# EAGLE design light_switch_smd (EAGLE 7.5.0)
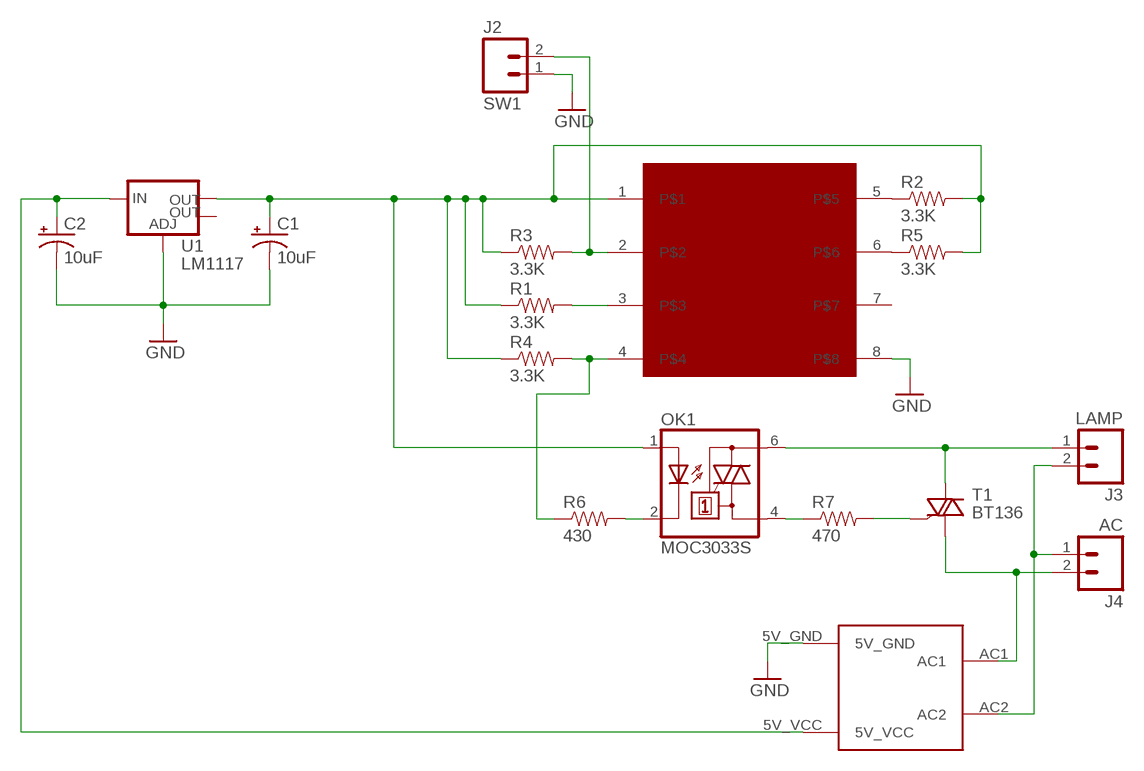
[diagram p0: schematic, sheet 1]

## Parts
C1  10uF  10UF-16V-10%(TANT)  [EIA3216]
C2  10uF  10UF-16V-10%(TANT)  [EIA3216]
J2  SW1  M02PTH3  [1X02_LONGPADS]
J3  LAMP  M02JST-PTH-VERT  [JST-2-PTH-VERT]
J4  AC  M02JST-PTH-VERT  [JST-2-PTH-VERT]
OK1  MOC3033S  [DIL6-SMD]
R1  3.3K  RESISTOR1206  [1206]
R2  3.3K  RESISTOR1206  [1206]
R3  3.3K  RESISTOR1206  [1206]
R4  3.3K  RESISTOR1206  [1206]
R5  3.3K  RESISTOR1206  [1206]
R6  430  RESISTOR1206  [1206]
R7  470  RESISTOR1206  [1206]
T1  BT136  [TO220AB]
U1  LM1117  V_REG_LM1117SOT223  [SOT223]
U$1  HI-LINK5V-ACDC  [AC5V]
U$2  ESP8266-01  [ESP8266-01]

## Nets
GND: C1.C(-) C2.C(-) J2.1 U1.1(ADJ) U$1.5V_GND U$2.8
N$1: J2.2 R3.2 U$2.2
N$2: R2.1 U$2.5
N$3: C1.A(+) OK1.1(A) R1.1 R2.2 R3.1 R4.1 R5.2 U1.2(OUT) U$2.1
N$4: R1.2 U$2.3
N$5: OK1.2(C) R6.2
N$6: R7.2 T1.3(G)
N$7: OK1.4(A1) R7.1
N$8: J3.1 OK1.6(A2) T1.2(A2)
N$9: R4.2 R6.1 U$2.4
N$11: J3.2 J4.1 U$1.AC2
N$12: J4.2 T1.1(A1) U$1.AC1
N$13: C2.A(+) U1.3(IN) U$1.5V_VCC
N$14: R5.1 U$2.6
Unconnected: U1.4(OUT) U$2.7

## Library data of the parts
C1 C2 = SparkFun-Capacitors:10UF-16V-10%(TANT): CAP-00811 1206/EIA-3216 Tantalum capacitor; PROD_ID: CAP-00811
J2-J4 = SparkFun-Connectors:M02: Standard 2-pin 0.1" header. Use with - straight break away headers ( PRT-00116) - right angle break away headers (PRT-00553) - swiss pins (PRT-00743) - machine pins (PRT-00117) - female headers (PRT-00115) Molex polarized connector foot print use with: PRT-08233 with associated crimp pins and housings. 2.54_SCREWTERM for use with PRT-10571. 3.5mm Screw Terminal footprints for PRT-08084 5mm Screw Terminal footprints for use with PRT-08432
OK1 = optocoupler:MOC30*: 6-Pin DIP Zero-Cross Optoisolators Triac Driver Output (250/400 Volt Peak) Source: Data sheet <http://www.fairchildsemi.com/ds/MO/MOC3031M.pdf> The old path of data sheet not more available 2013-05-06.; MF: FAIRCHILD SEMICONDUCTOR; MPN: MOC3033S-M; OC_FARNELL: unknown; OC_NEWARK: 05C2878
R1-R7 = SparkFun-Resistors:RESISTOR: Resistor Basic schematic elements and footprints for 0603, 1206, and PTH resistors.
T1 = triac:BT136: Triac BT136 series E sensitive gate Source: http://www.nxp.com/acrobat_download/datasheets/BT136_SERIES_E_2.pdf
U1 = SparkFun-PowerIC:V_REG_LM1117: Voltage Regulator LM1117 Standard adjustable voltage regulator but in SMD form. Spark Fun Electronics SKU : COM-00595; PROD_ID: VREG-08170
U$1 = myblog_library:HI-LINK5V-ACDC
U$2 = myblog_library:ESP8266-01: This is the famous esp8266 module board

## Net classes
0 default: width 0.762 mm, drill 0.762 mm, clearance 0.762 mm

## Board
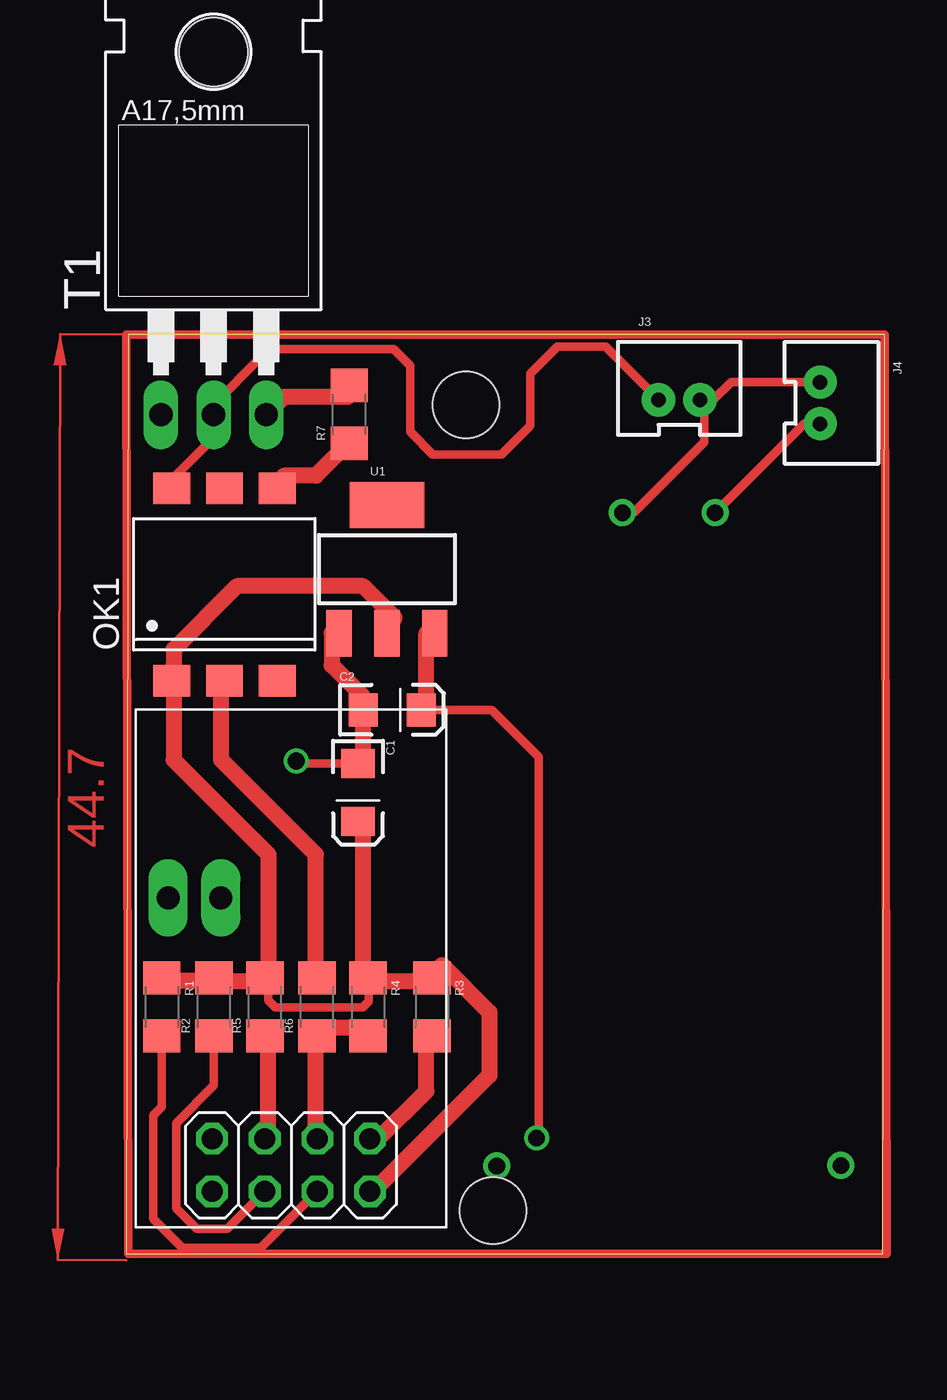
[diagram p1: board, top side]
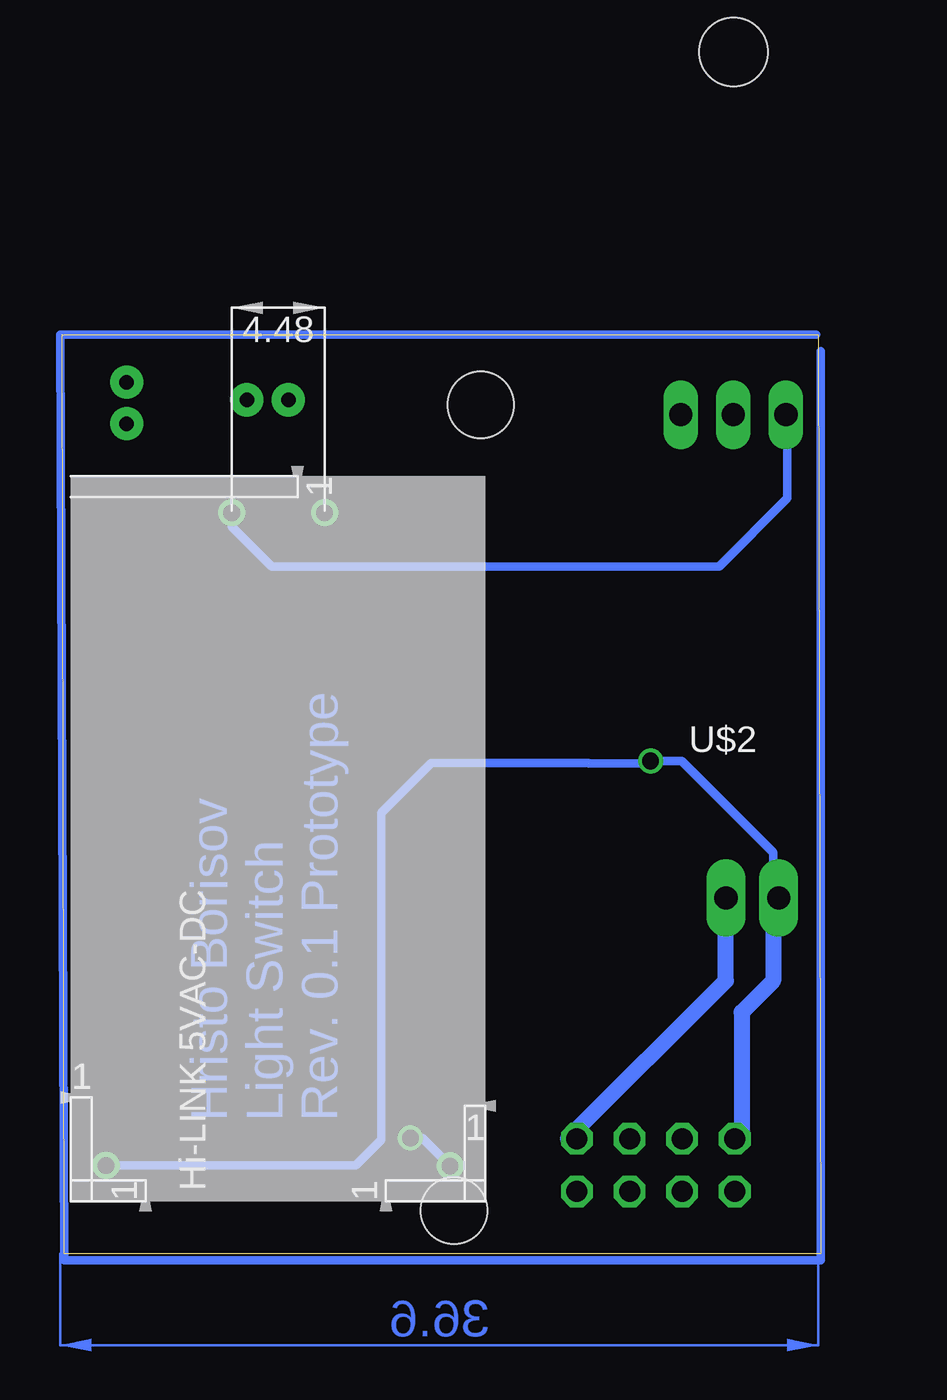
[diagram p2: board, bottom side, seen from below]

Size 36.6 x 44.4 mm. Coordinates in mm from the lower left corner, seen from the top.
Outline: 0,0 36.5,0 36.6,44.4 0.1,44.4 0,0
Copper layers (1*16): Top 0.035mm / dielectric 1.5mm / Bottom 0.035mm
Design rules "default": minimum track width 10mil, minimum drill 24mil, track to track 8mil, track to pad 8mil, pad to pad 8mil, via to via 8mil, smd to smd 8mil, copper to edge 40mil, drill to drill 8mil, minimum pad ring 10mil, minimum via ring 8mil, stop-mask expansion 4mil, vias tented up to drill 0mil, thermal gap 10mil
Holes 3.2 mm at 16.4,41 17.7,2.1

### Footprints (pad centres in the part's own frame; a part is rotated, then mirrored left to right if it is on the bottom)
EIA3216 = smd 1.4 x 1.6: A 1.4,0; C -1.4,0
1X02_LONGPADS = drill 1.118 pad 1.88 long: 1 0,0; 2 2.54,0
JST-2-PTH-VERT = drill 0.7 pad 1.6: 1 -1,-0.55; 2 1,-0.55
DIL6-SMD = smd 1.78 x 1.52: 1 -2.54,-4.645; 2 0,-4.645; 3 2.54,-4.645; 4 2.54,4.645; 5 0,4.645; 6 -2.54,4.645
1206 = smd 1.6 x 1.8: 1 -1.4,0; 2 1.4,0
TO220AB = drill 1.118 long: 1 -2.54,-6.35; 2 0,-6.35; 3 2.54,-6.35 | hole 3.302: 0,11.176
SOT223 = smd 1.219 x 2.235: 1 -2.311,-3.099; 2 0,-3.099; 3 2.311,-3.099 | smd 3.6 x 2.2: 4 0,3.099
AC5V = drill 0.8 pad 1.27: 5V_GND 1.72,18.31 | drill 0.8: 5V_VCC 1.7,1.7; AC1 33.24,12.24; AC2 33.24,7.76
ESP8266-01 = drill 1.016 octagon: 1 1.81,-1.27; 2 1.81,1.27; 3 -0.73,-1.27; 4 -0.73,1.27; 5 -3.27,-1.27; 6 -3.27,1.27; 7 -5.81,-1.27; 8 -5.81,1.27

### Placement (x,y rotation side)
C1  11.18,22.27 270 top
C2  12.83,26.27 0 top
J2  2.02,17.19 0 top
J3  26.69,41.79 0 top
J4  34.04,41.09 270 top
OK1  4.74,32.33 0 top
R1  1.71,11.92 270 top
R2  4.23,11.92 90 top
R3  14.75,11.92 270 top
R4  11.67,11.92 270 top
R5  6.69,11.92 90 top
R6  9.21,11.92 90 top
R7  10.76,40.54 90 top
T1  4.21,46.87 0 top
U1  12.58,33.06 0 top
U$1  16.18,2.55 90 bottom
U$2  9.95,4.29 0 top

### Tracks (layer width: path | path; a pad name or v marks a point on that pad's centre or on a via)
GND  (1 unrouted)
  Top 0.406: C1.C 8.33,23.67 8.3,23.7 | 8.3,23.7 8.1,23.7 8,23.8 8.2,23.8 8.3,23.7
  Top 0.762: C1.C 11.43,23.86 C2.C 11.43,26.91 9.91,28.43 9.91,29.96 U1.1
  Bottom 0.406: 2.29,17 2.29,19.39 6.7,23.8 8.2,23.8 8.33,23.67 C1.C 11.21,23.7 18.8,23.7 21.2,21.3 21.2,5.5 22.43,4.27 U$1.5V_GND
  Bottom 0.762: U$2.8 3.81,5.57 3.81,11.67 2.29,13.19 2.29,17 J2.1
N$1
  Top 0.762: R3.2 14.48,10.14 14.48,7.86 12.19,5.57 U$2.2
  Bottom 0.762: J2.2 4.57,17 4.57,13.19 12.19,5.57 U$2.2
N$2
  Top 0.406: R2.1 4.23,8.13 2.4,6.3 2.4,2.2 3.4,1.2 4.86,1.2 U$2.5
N$3
  Top 0.406: 6.86,13.95 6.86,12.24 7.2,11.9 11.4,11.9 11.7,12.2 11.7,13.29 R4.1
  Top 0.762: R1.1 2.29,13.19 3.81,13.19 R2.2 4.57,13.19 6.1,13.19 R5.2 6.86,13.95 6.86,19.29 2.29,23.86 2.29,27.67 OK1.1 2.29,28.43 2.29,29.19 5.33,32.24 11.43,32.24 12.95,30.72 U1.2 | C1.A 11.43,20.81 11.43,13.95 R4.1 12.19,13.19 14.48,13.19 R3.1 15.24,13.95 17.53,11.67 17.53,8.62 12.19,3.29 U$2.1
N$4
  Top 0.406: R1.2 1.71,7.11 1.3,6.7 1.3,1.7 2.7,0.3 6.5,0.3 U$2.3
N$5
  Top 0.762: OK1.2 4.57,27.67 4.57,23.86 9.14,19.29 9.14,13.95 R6.2
N$6
  Top 0.762: R7.2 10.67,41.39 7.62,41.39 6.86,40.62 T1.3
N$7
  Top 0.762: OK1.4 7.62,37.58 9.14,37.58 10.67,39.1 R7.1
N$8
  Top 0.406: OK1.6 2.2,37.4 4.3,39.5 4.3,40.43 T1.2 4.21,41.01 6.5,43.3 6.5,43.7 12.9,43.7 13.7,42.9 13.7,39.7 14.8,38.6 18.1,38.6 19.5,40 19.5,42.5 20.8,43.8 23.13,43.8 J3.1
N$9
  Top 0.762: R4.2 11.43,10.91 9.91,10.91 R6.1 9.14,10.14 9.14,5.57 U$2.4
N$10
  Top 0.406: 0,43.5 0,44.4 | 0,44.4 36.6,44.4 36.7,0 0.1,0 0,44.4
N$11
  Top 0.406: U$1.AC2 24.49,35.79 27.9,39.2 27.9,41.03 J3.2 28.34,41.24 29.2,42.1 J4.1
N$12
  Top 0.406: J4.2 32.72,40.09 U$1.AC1
  Bottom 0.406: U$1.AC1 28.42,35.12 26.5,33.2 4.9,33.2 1.6,36.5 1.6,40.45 T1.1
N$13  (via drill 0.8)
  Top 0.406: C2.A 17.63,26.27 19.9,24 19.9,5.7 v19.8,5.6
  Top 0.762: U1.3 14.48,29.96 14.48,26.91 C2.A
  Bottom 0.406: v19.8,5.6 19.23,5.6 U$1.5V_VCC
N$14
  Top 0.762: R5.1 6.86,10.14 6.86,5.57 U$2.6
N$15
  Bottom 0.406: 0.2,44.4 36.7,44.4 36.5,-0.3 0,-0.3 0,43.6
N$16  (via drill 0.8)
  other vias: 8.2,23.8
(copper drawn outside any net)
  shapes: Bottom area x1, Top area x1

### Text on the board
Bottom: Hristo Borisov / Light Switch / Rev. 0.1 Prototype